# EasyEDA Pro project ProPrj_transverter-front-end_2026-04-14.epro, board 1-PCB_PCB_transverter-core-board
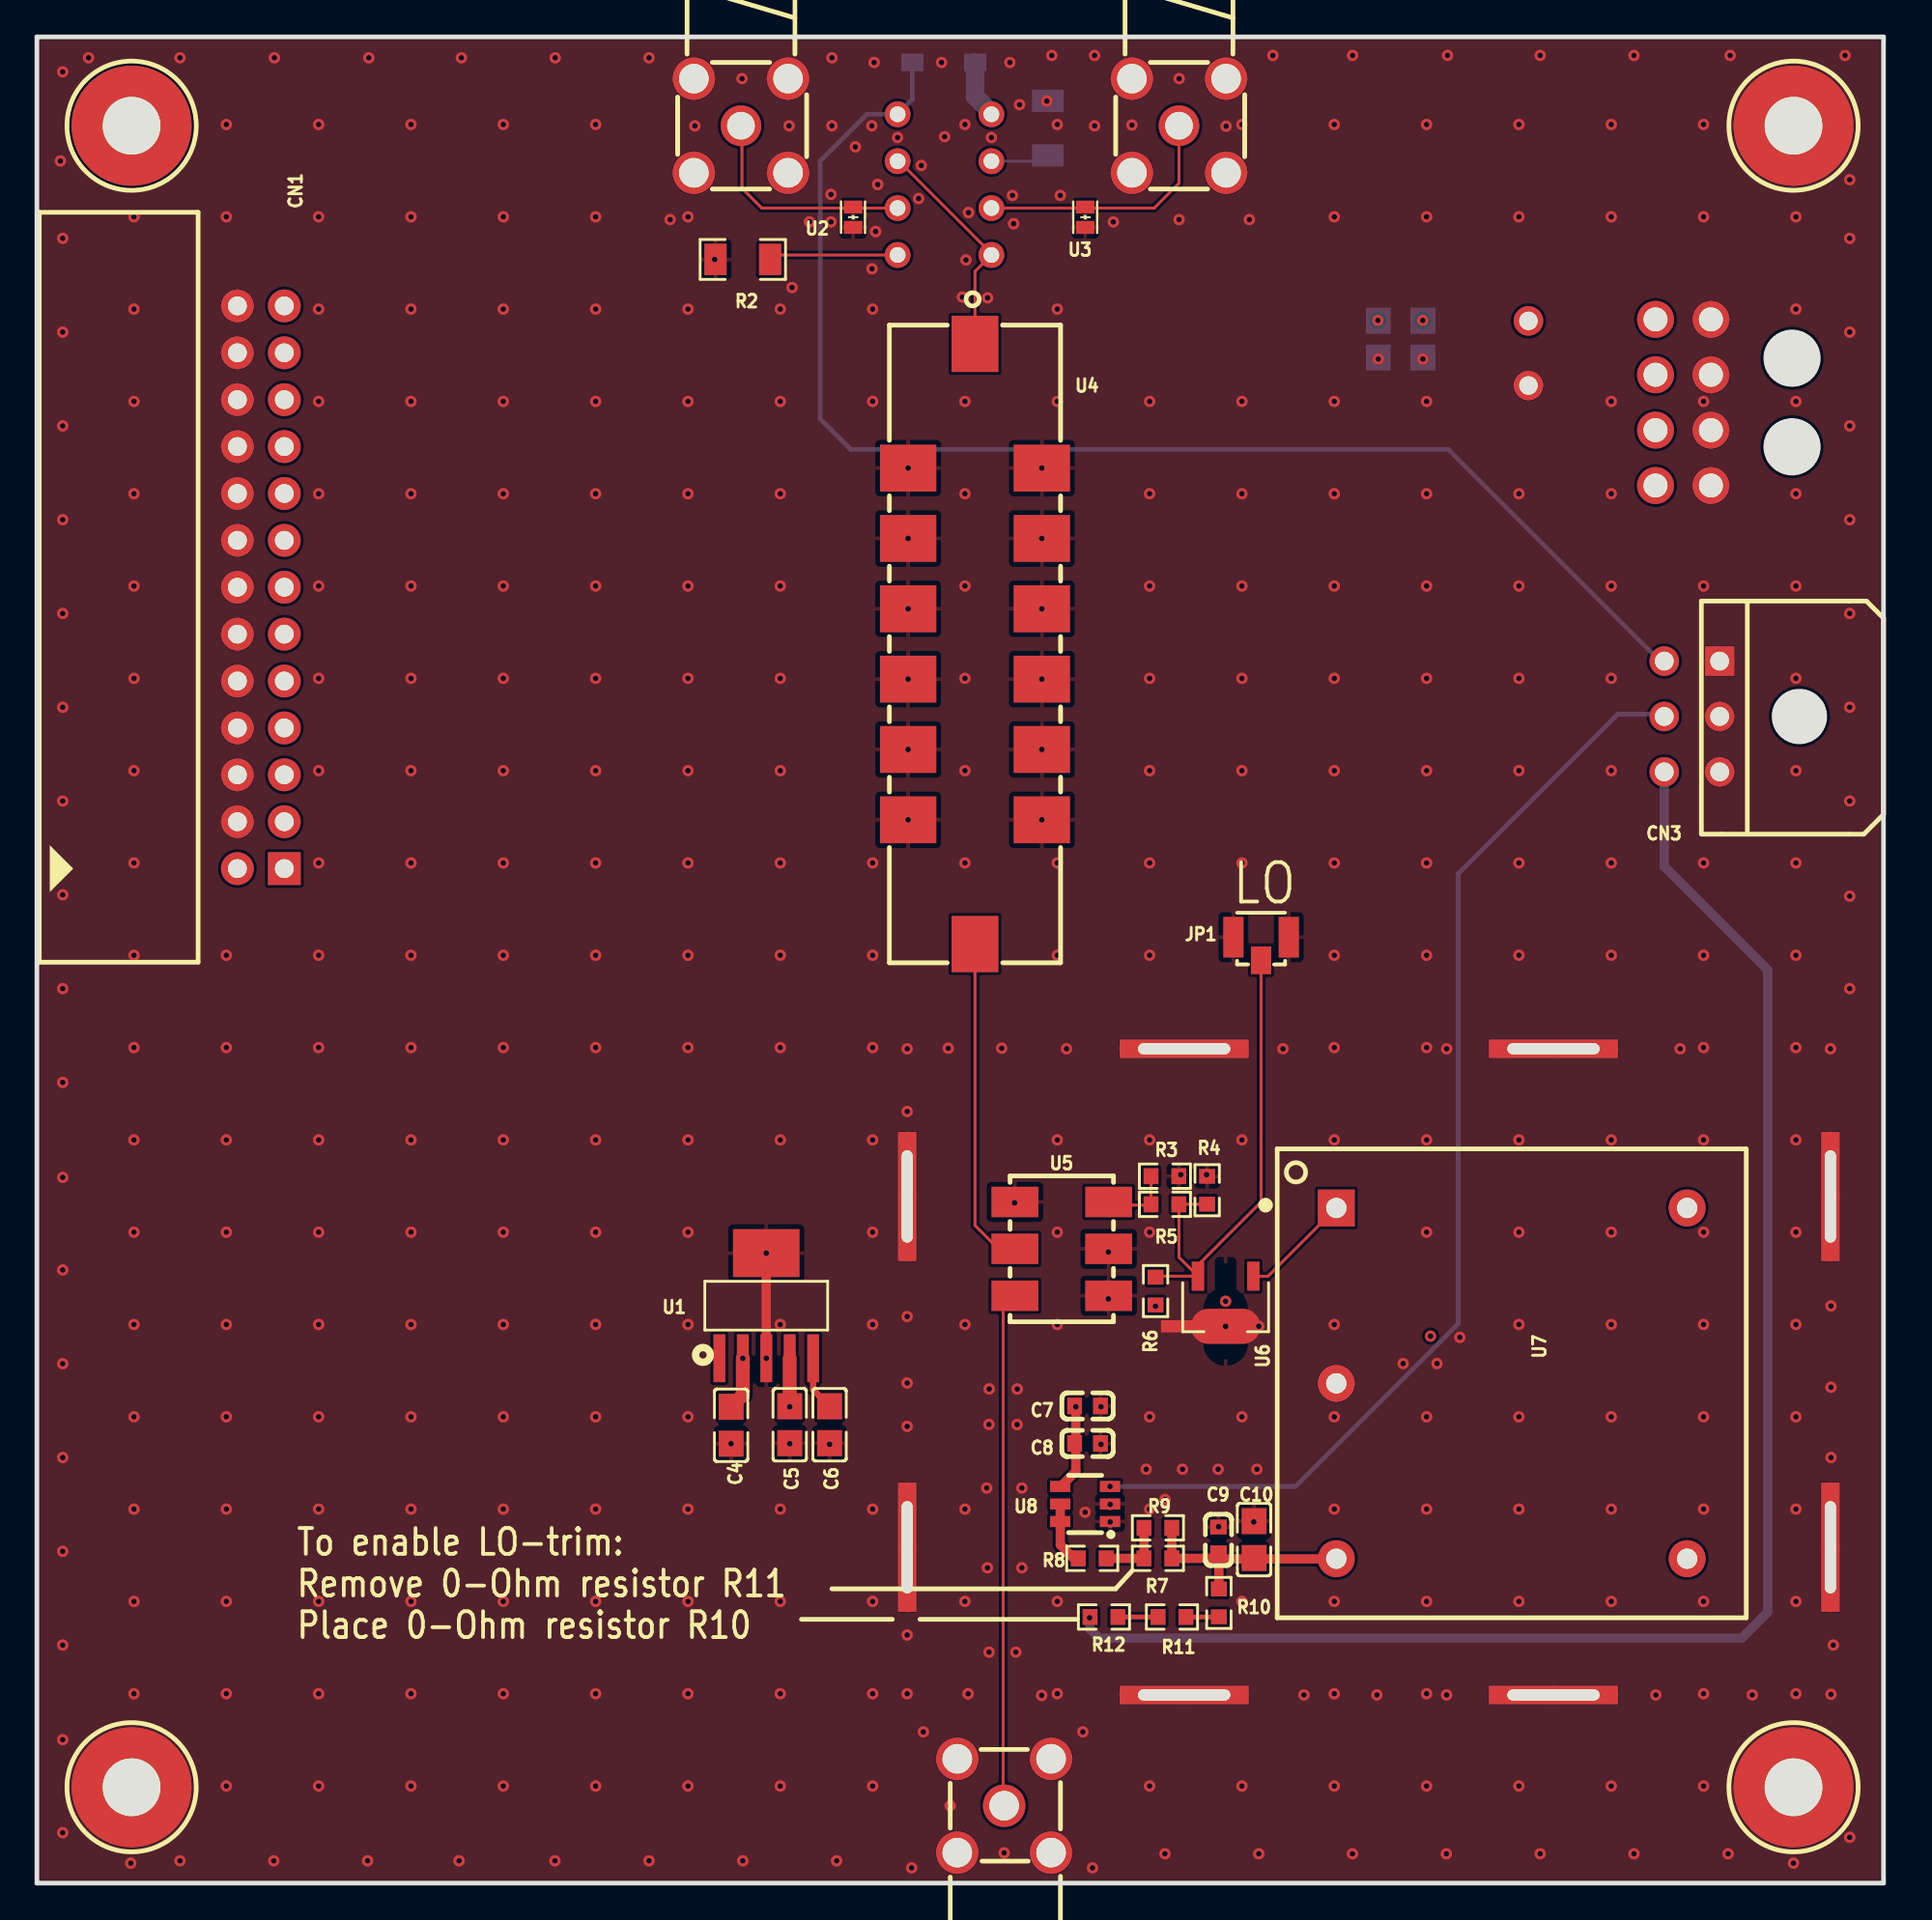
[diagram p5: board, top side]
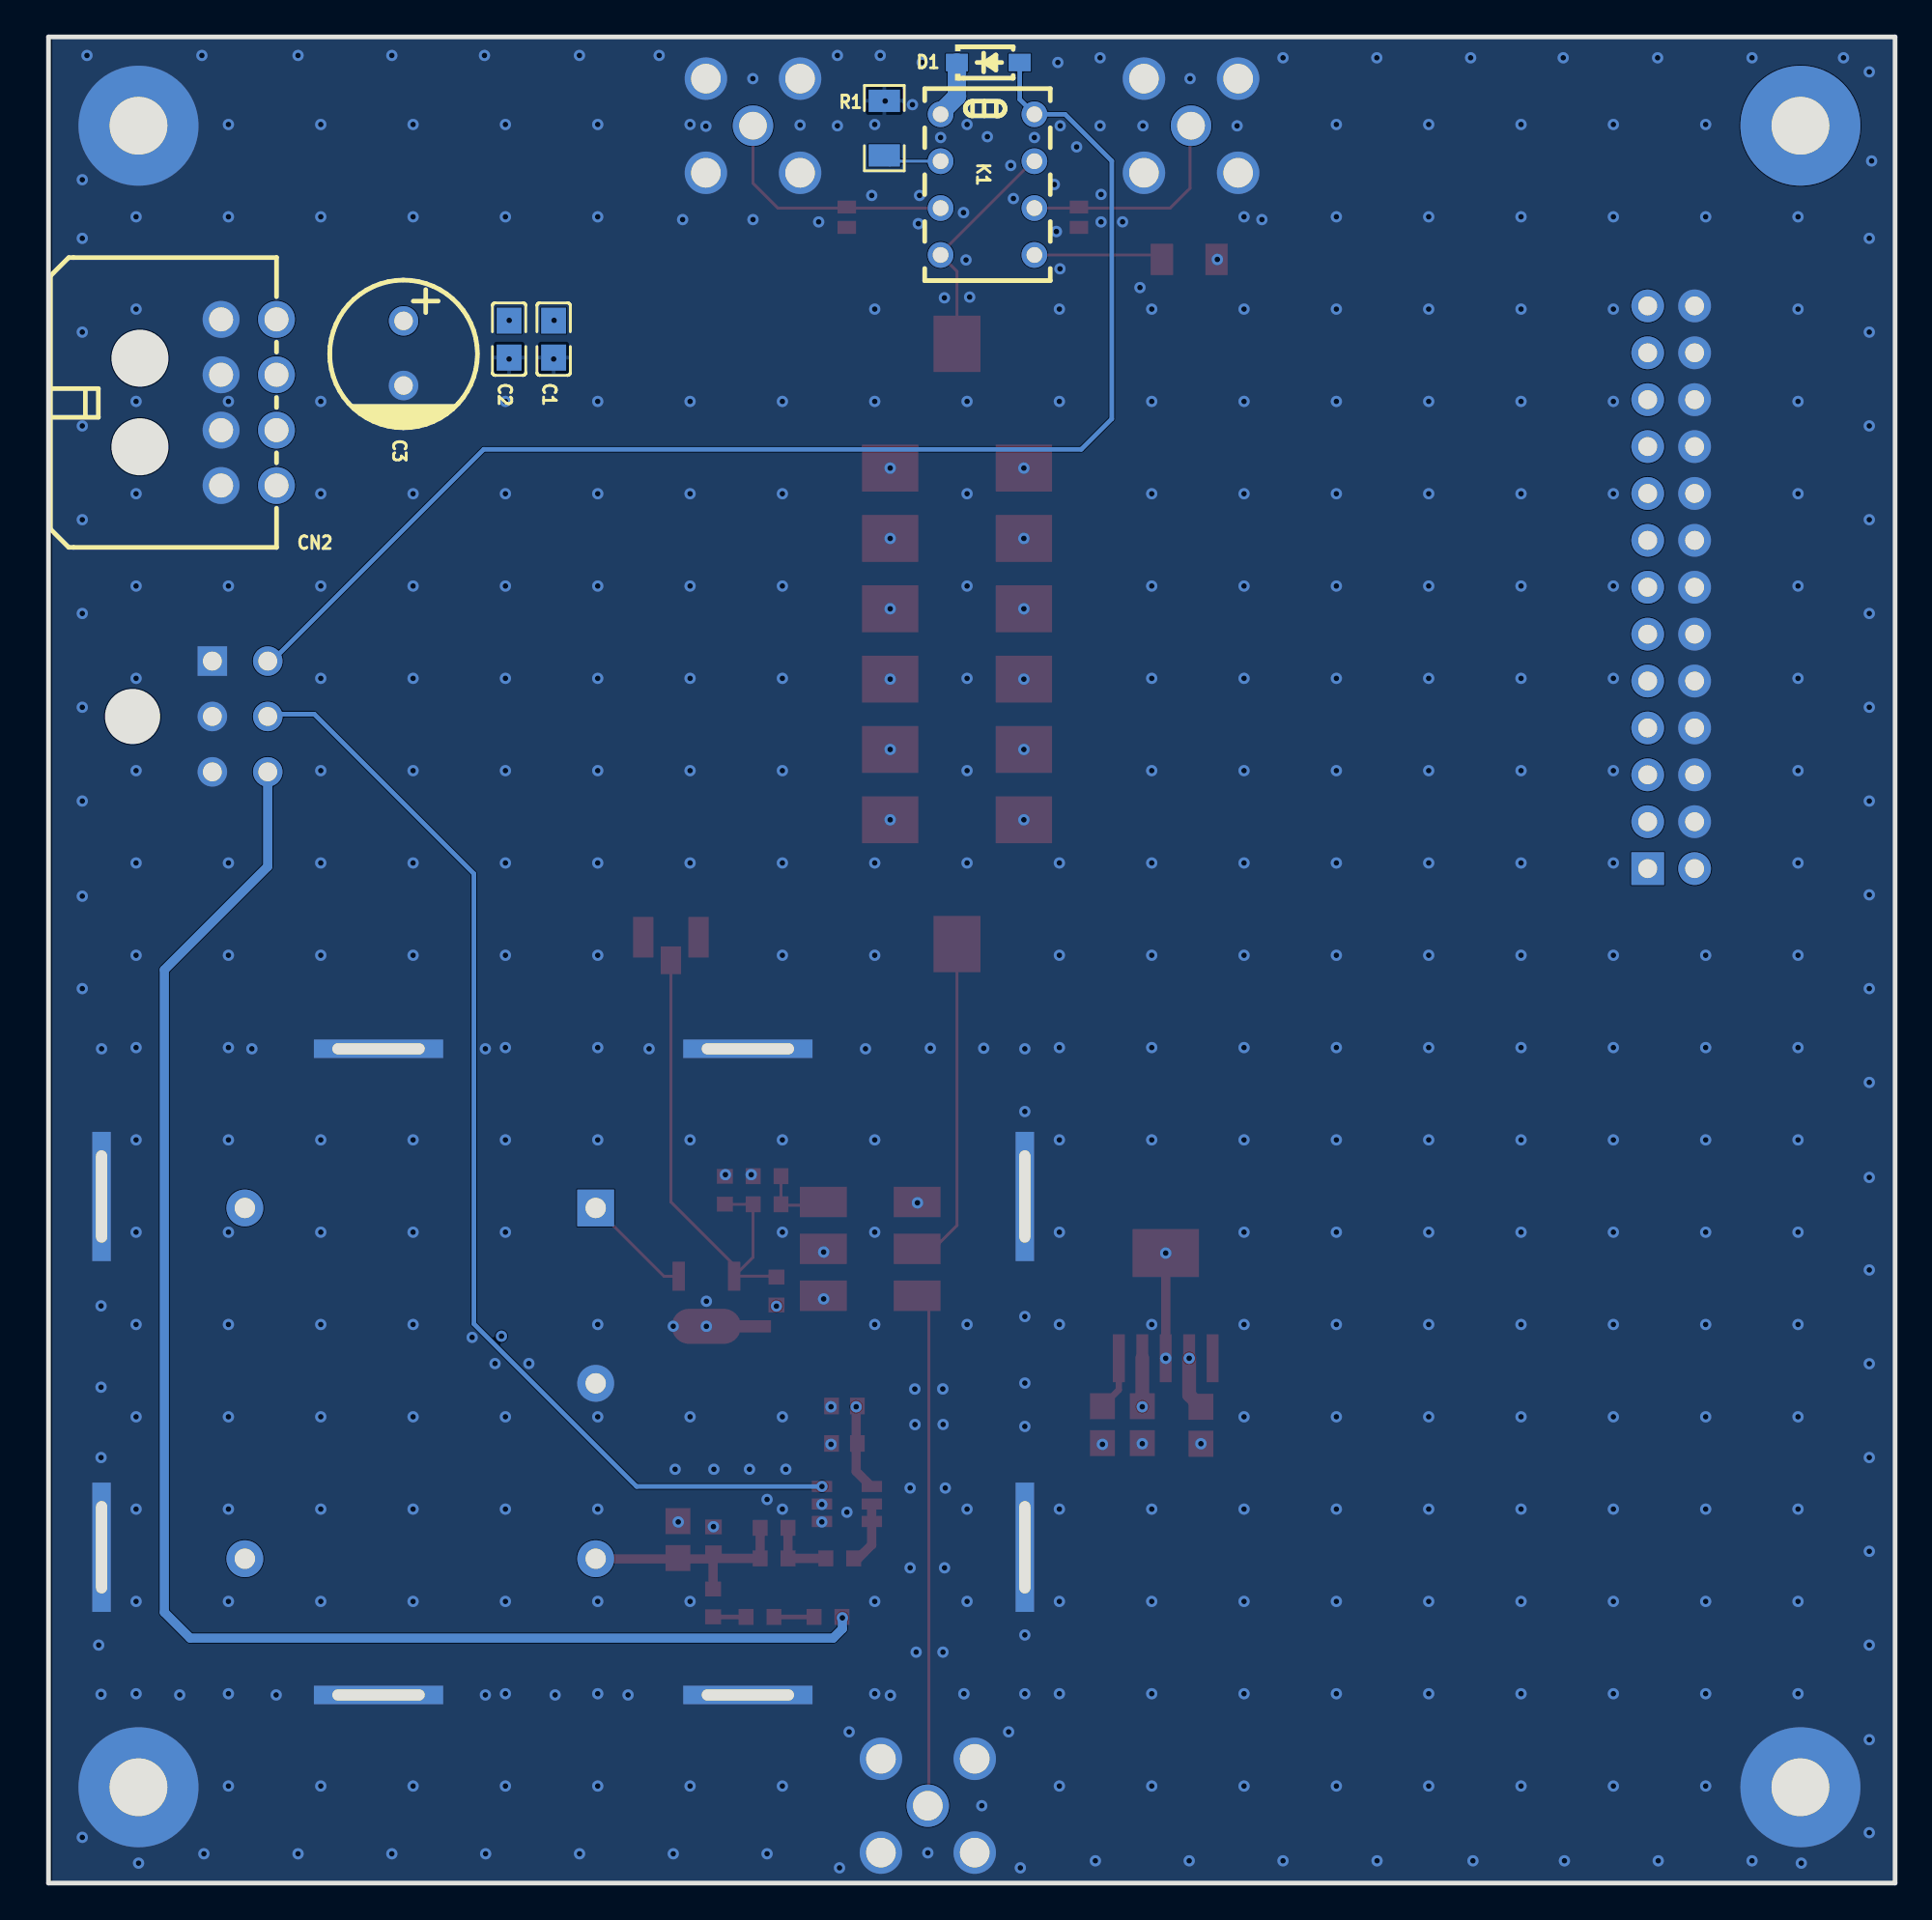
[diagram p6: board, bottom side, seen from below]

Outline 100 x 100 mm; copper layers: Top Layer, Inner1, Inner2, Bottom Layer. Coordinates in mm from the lower left corner of the outline.
Outline path: 0,100 100,100 100,0 0,0 0,100
Stack: Top Layer 0.035mm / Dielectric1 0.48mm PP er 4.5 / Inner1 0.035mm / Dielectric2 0.48mm FR4 er 4.5 / Inner2 0.035mm / Dielectric3 0.48mm PP er 4.5 / Bottom Layer 0.035mm

## Design rules (mm)
net TO-BPF: RF
net LO-AMP-OUT: RF
net LO-PI-PAD-OUT: RF
net LO-OUT: RF
net IF-BPF-IN: RF
net IF-BPF-OUT: RF
net RX_TERMINATION: RF
net TX_TERMINATION: RF
net RX: RF
net TX: RF
template: User Custom Config
spacing Default (default): track to track 0.152, other pairs 0 to 0.152
spacing RF: track to track 1, other pairs 0 to 0.65
spacing small_components: track to track 0.152, other pairs 0.152 to 0.3
spacing control_lines: track to track 0.5, other pairs 0.152 to 0.3
spacing small_power: track to track 0.6, other pairs 0.152 to 0.3
spacing main_power: track to track 2, other pairs 0.152 to 0.3
spacing clean_voltage: track to track 0.152, other pairs 0.152 to 0.3
spacing relay_power: track to track 1, other pairs 0.152 to 0.3
spacing ground_guard: track to track 0.3, other pairs 0.152 to 0.3
track width Default (default): min 0.254, default 0.254, max 25.4
track width RF: min 0.157, default 0.157, max 0.157
track width control_lines: min 0.25, default 0.25, max 0.26
track width small_power: min 0.5, default 0.5, max 2.54
track width main_power: min 1.5, default 1.5, max 3
track width relay_power: min 1, default 1, max 1.25
differential pair differentialPair (default): width min 0.127, default 0.254, max 2.54; gap min 0.152, default 0.152
via Default (default): diameter min 0.61, default 0.61, max 100.025; hole min 0.305, default 0.305, max 59.995
via RF: diameter min 0.61, default 0.61, max 100.025; hole min 0.305, default 0.305, max 59.995
net class RF uses RF
net NOISY-5V uses relay_power
net RLY-TXRX-EN uses control_lines
net NOISY-5.3V uses small_power
net CLEAN-5V uses clean_voltage, small_power
net TO-BPF uses RF
net LO-VREF uses small_power
net LO-TRIM uses small_power
net 2.5V-REF uses clean_voltage, small_power
net LO-AMP-OUT uses RF
net LO-PI-PAD-OUT uses RF
net LO-OUT uses RF
net IF-BPF-IN uses RF
net IF-BPF-OUT uses RF
net RX_TERMINATION uses RF
net TX_TERMINATION uses RF
net RX uses RF
net TX uses RF
net 2.5V-REF-EN uses control_lines
['net class', 'rf'] ['NET', 'GND'] uses ground_guard
pour e48 uses gge25779
pour e50 uses gge19105
pour e28 uses Default

## Placement (name value [footprint] x y rotation side)
C1  100nF  [C0805]  72.64 83.63 270 bottom
C2  1uF  [C0805]  75.06 83.63 270 bottom
C3  47 µF  [CAP-TH_BD8.0-P3.50-D0.6-FD]  80.77 82.87 270 bottom
C4  2.2uF  [C0805]  37.59 24.8 270 top
C5  1uF  [C0805]  40.77 24.83 90 top
C6  2.2uF  [C0805]  42.93 24.83 90 top
C7  100nF  [C0603]  56.9 25.84 180 top
C8  1uF  [C0603]  56.9 23.81 0 top
C9  100nF  [C0603]  63.99 18.59 270 top
C10  10uF  [C0805]  65.91 18.61 90 top
CN1  SBH11-PBPC-D13-RA-BK  [IDC-TH_26P-P2.54-H-M-R2-C13-W8.8]  12.13 70.19 270 top
CN2  4x2 connector  [CONN-TH_0430450800]  89.15 80.2 270 bottom
CN3  430450602  [CONN-TH_6P-P3.00_43045-0600]  89.63 63.19 90 top
D1  1N4148W-7-F  [SOD-123_L2.7-W1.6-LS3.7-RD-1]  49.1 98.62 180 bottom
JP1  U.FL-R-SMT-1(10)  [ANT-SMD_UFL-R-SMT-1-10]  66.29 50.61 90 top
K1  G6K-2P DC5  [RELAY-TH_G6K-2P]  49.15 92 270 bottom
NOREF  -  [Pad_e4738]  47.13 37.19 0 top
NOREF#2  -  [Pad_e2649]  5.13 95.19 0 top
NOREF#3  -  [Pad_e4742]  62.13 45.19 270 top
NOREF#4  -  [Pad_e1800]  47.13 18.19 0 top
NOREF#5  -  [Pad_e2651]  95.13 95.19 0 top
NOREF#6  -  [Pad_e4739]  97.13 18.19 0 top
NOREF#7  -  [Pad_e4744]  62.13 10.19 270 top
NOREF#8  -  [Pad_e4743]  82.13 10.19 270 top
NOREF#9  -  [Pad_e4741]  82.13 45.19 270 top
NOREF#10  -  [Pad_e2652]  95.13 5.19 0 top
NOREF#11  -  [Pad_e2653]  5.13 5.19 0 top
NOREF#12  -  [Pad_e4740]  97.13 37.19 0 top
R1  50Ω  [R1206]  54.74 95.06 90 bottom
R2  50Ω  [R1206]  38.23 87.95 0 top
R3  470Ω  [R0603_NEW]  61.09 38.29 180 top
R4  470Ω  [R0603_NEW]  63.37 37.53 270 top
R5  10Ω  [R0603_NEW]  61.09 36.77 0 top
R6  0Ω  [R0603_NEW]  60.58 32.07 90 top
R7  0Ω  [R0603_NEW]  60.71 17.59 180 top
R8  100Ω  [R0603]  57.15 17.59 180 top
R9  1kΩ  [R0603_NEW]  60.71 19.24 180 top
R10  200kΩ  [R0603]  64.01 15.18 270 top
R11  1kΩ  [R0603_NEW]  61.47 14.41 180 top
R12  0Ω  [R0603_NEW]  57.78 14.41 180 top
SMA1  RX1  [SMA-TH_CONSMA002-L-G]  38.13 95.19 90 top
SMA2  TX1  [SMA-TH_CONSMA002-L-G]  61.85 95.19 90 top
SMA3  TO-CONTROL  [ANT-TH_SMA-J-P-H-RA-TH1]  52.38 4.19 90 top
U1  TPS79650DCQR  [SOT-223-6_L6.5-W3.5-P1.27-LS7.0-BR]  39.5 31.28 270 top
U2  CPDUR5V0R-HF  [SOD-523F_L1.7-W1.0-BI]  44.2 90.23 90 top
U3  CPDUR5V0R-HF  [SOD-523F_L1.7-W1.0-BI]  56.77 90.23 90 top
U4  BPF-A120+  [FILTER-SMD_14P-L34.5-W9.3_BPF-A950]  50.8 67.12 270 top
U5  ADE-1MHW+  [XFMR-SMD_L7.9-W5.6-P2.54_ADTT1-6]  55.5 34.35 270 top
U6  GVA-81+  [SOT-89-3_L4.5-W2.4-P1.50-LS4.0-BR]  64.37 31.51 90 top
U7  OH100-71005SV-100.0M  [OSC-TH_5P-L25.4-W25.4-P9.50-TL]  79.87 27.07 0 top
U8  REF3425IDBVR  [SOT-23-6_L2.9-W1.6-P0.95-LS2.8-BR]  56.76 20.53 0 top

## Footprints (pads in the part's own frame, mm; a bottom-side part is the same pattern mirrored in y, then rotated)
ANT-SMD_UFL-R-SMT-1-10
  rect 2.2x1.1 smd: 1(0.625,1.5) 3(0.625,-1.5)
  rect 1.5x1.1 smd: 2(-0.625,0.002)
ANT-TH_SMA-J-P-H-RA-TH1
  round 2.3 hole 1.6: 1(-2.54,2.54) 2(2.54,2.54) 3(2.54,-2.54) 4(-2.54,-2.54) 5(0,0)
C0603
  rect 0.8x0.9 smd: 1(-0.7,0) 2(0.7,0)
C0805
  rect 1.41x1.35 smd: 1(-1,0) 2(1,0)
CAP-TH_BD8.0-P3.50-D0.6-FD
  round 1.6 hole 1: 1(-1.75,0) 2(1.75,0)
CONN-TH_6P-P3.00_43045-0600
  rect 1.6x1.6 hole 1.02: 1(3,-1.5)
  round 1.6 hole 1.02: 2(0,-1.5) 3(-3,-1.5) 4(3,1.5) 5(0,1.5) 6(-3,1.5)
CONN-TH_0430450800
  round 2 hole 1.3: 1(4.5,-1.5) 2(1.5,-1.5) 3(-1.5,-1.5) 4(-4.5,-1.5) 5(4.5,1.5) 6(1.5,1.5) 7(-1.5,1.5) 8(-4.5,1.5)
FILTER-SMD_14P-L34.5-W9.3_BPF-A950
  rect 3.05x2.54 smd: 1(-16.255,0) 8(16.255,0)
  rect 2.54x3.05 smd: 2(-9.525,-3.62) 3(-5.715,-3.62) 4(-1.905,-3.62) 5(1.905,-3.62) 6(5.715,-3.62) 7(9.525,-3.62) 9(9.525,3.62) 10(5.715,3.62) 11(1.905,3.62) 12(-1.905,3.62) 13(-5.715,3.62) 14(-9.525,3.62)
IDC-TH_26P-P2.54-H-M-R2-C13-W8.8
  rect 1.778x1.778 hole 1.02: 1(15.24,1.27)
  round 1.778 hole 1.02: 2(15.24,-1.27) 3(12.7,1.27) 4(12.7,-1.27) 5(10.16,1.27) 6(10.16,-1.27) 7(7.62,1.27) 8(7.62,-1.27) 9(5.08,1.27) 10(5.08,-1.27) 11(2.54,1.27) 12(2.54,-1.27) 13(0,1.27) 14(0,-1.27) 15(-2.54,1.27) 16(-2.54,-1.27) 17(-5.08,1.27) 18(-5.08,-1.27) 19(-7.62,1.27) 20(-7.62,-1.27) 21(-10.16,1.27) 22(-10.16,-1.27) 23(-12.7,1.27) 24(-12.7,-1.27) 25(-15.24,1.27) 26(-15.24,-1.27)
OSC-TH_5P-L25.4-W25.4-P9.50-TL
  rect 2x2 hole 1.1: 1(-9.5,9.5)
  round 2 hole 1.1: 2(-9.5,0) 3(-9.5,-9.5) 4(9.5,-9.5) 5(9.5,9.5)
Pad_e1800
  rect 1x7 hole 0.6x5: 1(0,0)
Pad_e2649
  round 6.5 hole 3.125: 1(0,0)
Pad_e2651
  round 6.5 hole 3.125: 1(0,0)
Pad_e2652
  round 6.5 hole 3.125: 1(0,0)
Pad_e2653
  round 6.5 hole 3.125: 1(0,0)
Pad_e4738
  rect 1x7 hole 0.6x5: 1(0,0)
Pad_e4739
  rect 1x7 hole 0.6x5: 1(0,0)
Pad_e4740
  rect 1x7 hole 0.6x5: 1(0,0)
Pad_e4741
  rect 1x7 hole 0.6x5: 1(0,0)
Pad_e4742
  rect 1x7 hole 0.6x5: 1(0,0)
Pad_e4743
  rect 1x7 hole 0.6x5: 1(0,0)
Pad_e4744
  rect 1x7 hole 0.6x5: 1(0,0)
R0603
  rect 0.806x0.864 smd: 1(-0.753,0) 2(0.753,0)
R0603_NEW
  rect 0.806x0.864 smd: 1(-0.753,0) 2(0.753,0)
R1206
  rect 1.208x1.701 smd: 1(-1.479,0) 2(1.479,0)
RELAY-TH_G6K-2P
  round 1.4 hole 0.85: 1(-3.81,-2.54) 2(-1.27,-2.54) 3(1.27,-2.54) 4(3.81,-2.54) 5(3.81,2.54) 6(1.27,2.54) 7(-1.27,2.54) 8(-3.81,2.54)
SMA-TH_CONSMA002-L-G
  round 2.2 hole 1.5: 1(0,0)
  round 2.3 hole 1.6: 2(-2.55,2.55) 3(-2.55,-2.55) 4(2.55,-2.55) 5(2.55,2.55)
SOD-123_L2.7-W1.6-LS3.7-RD-1
  rect 1.2x0.95 smd: 1(-1.7,0) 2(1.7,0)
SOD-523F_L1.7-W1.0-BI
  rect 0.7x1 smd: 1(-0.55,0) 2(0.55,0)
SOT-23-6_L2.9-W1.6-P0.95-LS2.8-BR
  rect 1.1x0.6 smd: 1(1.35,-0.95) 2(1.35,0) 3(1.35,0.95) 4(-1.35,0.95) 5(-1.35,0) 6(-1.35,-0.95)
SOT-89-3_L4.5-W2.4-P1.50-LS4.0-BR
  rect 1.575x0.672 smd: 1(1.357,-1.5) 3(1.357,1.5)
  custom 1.9x5.377 smd: 2(-1.357,-0.001)
SOT-223-6_L6.5-W3.5-P1.27-LS7.0-BR
  rect 2.595x0.644 smd: 1(2.848,-2.54) 2(2.848,-1.27) 3(2.848,0) 4(2.848,1.27) 5(2.848,2.54)
  rect 2.595x3.6 smd: 6(-2.848,0)
XFMR-SMD_L7.9-W5.6-P2.54_ADTT1-6
  rect 1.65x2.54 smd: 1(-2.54,-2.54) 2(0,-2.54) 3(2.54,-2.54) 4(2.54,2.54) 5(0,2.54) 6(-2.54,2.54)

## Nets
As in the schematic, except:
GND: C1.2 C2.2 C3.2 C4.2 C5.1 C6.1 C7.1 C8.2 C9.1 C10.2 CN1.4 CN1.6 CN1.8 CN1.10 CN1.12 CN1.14 CN1.16 CN1.18 CN1.20 CN1.22 CN1.24 CN1.26 CN2.1 CN2.2 CN2.3 CN2.4 CN3.1 CN3.2 CN3.3 JP1.1 JP1.3 NOREF.1 NOREF#3.1 NOREF#4.1 NOREF#5.1 NOREF#6.1 NOREF#7.1 NOREF#8.1 NOREF#9.1 NOREF#10.1 NOREF#11.1 NOREF#12.1 R1.2 R2.1 R3.1 R4.1 SMA1.2 SMA1.3 SMA1.4 SMA1.5 SMA2.2 SMA2.3 SMA2.4 SMA2.5 SMA3.1 SMA3.2 SMA3.3 SMA3.4 U1.3 U1.6 U2.1 U3.1 U4.2 U4.3 U4.4 U4.5 U4.6 U4.7 U4.9 U4.10 U4.11 U4.12 U4.13 U4.14 U5.1 U5.4 U5.5 U6.2 U7.2 U8.1 U8.2

Pads without a net: CN1 1 2 3 5 7 9 11 13 15 17 19 21 23 25; NOREF#2 1; U1 1; U7 4

## Via types
v1: diameter 0.61, hole 0.305, Top Layer to Bottom Layer, 445 vias
v2: diameter 0.62, hole 0.31, Top Layer to Bottom Layer, 42 vias

## Routing (per net, layer and track width the routed paths; a pad name or vN(x,y) marks a point on that pad's centre or on a via; arc(x,y) is an arc through that point)
2.5V-REF: length 3.5
  Top Layer w0.5: U8.5 55.42,20.53 55.42,18.32 56.15,17.59 R8.2
2.5V-REF-EN: length 61.7
  Bottom Layer w0.254: CN3.5 88,63.32 85.61,63.32 76.96,54.67 76.96,30.29 68.16,21.48 v1(58.11,21.48)
GND: length 5.7
  Top Layer w0.5: v2(39.5,28.43) v2(39.5,34.12)
  vias: v1(1.27,93.28) v1(1.4,98.11) v1(1.4,89.09) v1(1.4,84.01) v1(1.4,78.93) v1(1.4,73.85) v1(1.4,68.77) v1(1.4,63.69) v1(1.4,58.61) v1(1.4,53.53) v1(1.4,48.45) v1(1.4,43.37) v1(1.4,38.22) v1(1.4,33.21) v1(1.4,28.13) v1(1.4,23.05) v1(1.4,17.97) v1(1.4,12.89) v1(1.4,7.77) v1(1.4,2.73) v1(2.79,98.87) v1(5.08,1.08) v1(5.26,90.26) v1(5.26,85.26) v1(5.26,80.26) v1(5.26,75.26) v1(5.26,70.26) v1(5.26,65.26) v1(5.26,60.26) v1(5.26,55.26) v1(5.26,50.26) v1(5.26,45.26) v1(5.26,40.26) v1(5.26,35.26) v1(5.26,30.26) v1(5.26,25.26) v1(5.26,20.26) v1(5.26,15.26) v1(5.26,10.26) v1(7.75,98.87) v1(7.75,1.21) v1(10.26,95.26) v1(10.26,90.26) v1(10.26,50.26) v1(10.26,45.26) v1(10.26,40.26) v1(10.26,35.26) v1(10.26,30.26) v1(10.26,25.26) v1(10.26,20.26) v1(10.26,15.26) v1(10.26,10.26) v1(10.26,5.26) v1(12.86,98.87) v1(12.83,1.21) v1(15.26,95.26) v1(15.26,90.26) v1(15.26,85.26) v1(15.26,80.26) v1(15.26,75.26) v1(15.26,70.26) v1(15.26,65.26) v1(15.26,60.26) v1(15.26,55.26) v1(15.26,50.26) v1(15.26,45.26) v1(15.26,40.26) v1(15.26,35.26) v1(15.26,30.26) v1(15.26,25.26) v1(15.26,20.26) v1(15.26,15.26) v1(15.26,10.26) v1(15.26,5.26) v1(17.97,98.87) v1(17.91,1.21) v1(20.26,95.26) v1(20.26,90.26) v1(20.26,85.26) v1(20.26,80.26) v1(20.26,75.26) v1(20.26,70.26) v1(20.26,65.26) v1(20.26,60.26) v1(20.26,55.26) v1(20.26,50.26) v1(20.26,45.26) v1(20.26,40.26) v1(20.26,35.26) v1(20.26,30.26) v1(20.26,25.26) v1(20.26,20.26) v1(20.26,15.26) v1(20.26,10.26) v1(20.26,5.26) v1(22.86,1.21) v1(22.99,98.87) v1(25.26,95.26) v1(25.26,90.26) v1(25.26,85.26) v1(25.26,80.26) v1(25.26,75.26) v1(25.26,70.26) v1(25.26,65.26) v1(25.26,60.26) v1(25.26,55.26) v1(25.26,50.26) v1(25.26,45.26) v1(25.26,40.26) v1(25.26,35.26) v1(25.26,30.26) v1(25.26,25.26) v1(25.26,20.26) v1(25.26,15.26) v1(25.26,10.26) v1(25.26,5.26) v1(28.07,98.87) v1(28.05,1.21) v1(30.26,95.26) v1(30.26,90.26) v1(30.26,85.26) v1(30.26,80.26) v1(30.26,75.26) v1(30.26,70.26) v1(30.26,65.26) v1(30.26,60.26) v1(30.26,55.26) v1(30.26,50.26) v1(30.26,45.26) v1(30.26,40.26) v1(30.26,35.26) v1(30.26,30.26) v1(30.26,25.26) v1(30.26,20.26) v1(30.26,15.26) v1(30.26,10.26) v1(30.26,5.26) v1(33.15,98.87) v1(33.15,1.21) v1(34.29,90.11) v1(35.26,90.26) v1(35.26,85.26) v1(35.26,80.26) v1(35.26,75.26) v1(35.26,70.26) v1(35.26,65.26) v1(35.26,60.26) v1(35.26,55.26) v1(35.26,50.26) v1(35.26,45.26) v1(35.26,40.26) v1(35.26,35.26) v1(35.26,30.26) v1(35.26,25.26) v1(35.26,20.26) v1(35.26,15.26) v1(35.26,10.26) v1(35.26,5.26) v1(35.63,95.18) v1(38.18,97.74) v1(38.23,1.21) v1(40.26,85.26) v1(40.26,80.26) v1(40.26,75.26) v1(40.26,70.26) v1(40.26,65.26) v1(40.26,60.26) v1(40.26,55.26) v1(40.26,50.26) v1(40.26,45.26) v1(40.26,40.26) v1(40.26,30.26) v1(40.26,20.26) v1(40.26,15.26) v1(40.26,10.26) v1(40.26,5.26) v1(40.73,95.18) v1(40.89,86.42) v1(41.83,89.98) v1(43.05,98.87) v1(43.05,95.19) v1(43,91.47) v1(43,89.98) v1(43.31,1.21) v1(44.32,94.04) v1(45.21,95.19) v1(45.22,87.44) v1(45.26,85.26) v1(45.26,80.26) v1(45.26,55.26) v1(45.26,50.26) v1(45.26,45.26) v1(45.26,40.26) v1(45.26,35.26) v1(45.26,30.26) v1(45.26,20.26) v1(45.26,15.26) v1(45.26,10.26) v1(45.26,5.26) v1(45.34,98.62) v1(46.61,94.55) v1(47.13,45.19) v1(47.13,41.79) v1(47.13,30.69) v1(47.13,27.08) v1(47.13,24.73) v1(47.13,13.44) v1(47.13,10.25) v1(47.37,0.83) v1(47.75,91.25) v1(47.89,93.04) v1(48.01,8.19) v1(48.99,98.62) v1(49.16,94.6) v1(49.35,45.22) v1(49.46,4.19) v1(50.12,85.91) v1(50.26,95.26) v1(50.26,80.26) v1(50.26,75.26) v1(50.26,70.26) v1(50.26,65.26) v1(50.26,60.26) v1(50.26,55.26) v1(50.26,30.26) v1(50.26,20.26) v1(50.26,15.26) v1(50.31,87.92) v1(51.43,21.4) v1(51.47,17.08) v1(51.48,85.87) v1(51.55,24.84) v1(51.56,12.51) v1(51.69,94.55) v1(52.25,45.22) v1(52.38,1.64) v1(52.69,98.62) v1(52.83,91.41) v1(53.01,12.51) v1(53.21,96.33) v1(53.34,21.4) v1(53.34,17.08) v1(54.96,99) v1(55.26,95.26) v1(55.26,85.26) v1(55.26,80.26) v1(55.26,55.26) v1(55.26,50.26) v1(55.26,40.26) v1(55.26,35.26) v1(55.26,30.26) v1(55.26,15.26) v1(55.26,10.26) v1(55.42,91.41) v1(55.76,45.19) v1(56.64,8.19) v1(56.76,20.09) v1(57.16,0.83) v1(57.28,99) v1(57.28,95.19) v1(58.12,20.51) v1(58.12,19.56) v1(58.29,89.98) v1(59.3,95.23) v1(60.07,22.42) v1(60.26,80.26) v1(60.26,75.26) v1(60.26,70.26) v1(60.26,65.26) v1(60.26,60.26) v1(60.26,55.26) v1(60.26,50.26) v1(60.26,40.26) v1(60.26,35.26) v1(60.26,25.26) v1(60.26,20.26) v1(60.26,5.26) v1(61.09,20.78) v1(61.09,1.59) v1(61.86,97.74) v1(61.85,90.11) v1(62.04,22.42) v1(63.97,22.42) v1(64.37,31.51) v1(64.4,95.16) v1(65.26,95.26) v1(65.26,80.26) v1(65.26,75.26) v1(65.26,70.26) v1(65.26,65.26) v1(65.26,60.26) v1(65.26,55.26) v1(65.26,40.26) v1(65.26,25.26) v1(65.26,15.26) v1(65.26,5.26) v1(65.66,90.11) v1(66.06,22.42) v1(66.17,30.16) v1(66.17,1.59) v1(66.93,99) v1(67.47,45.19) v1(68.61,10.19) v1(70.26,95.26) v1(70.26,90.26) v1(70.26,80.26) v1(70.26,75.26) v1(70.26,70.26) v1(70.26,65.26) v1(70.26,60.26) v1(70.26,55.26) v1(70.26,50.26) v1(70.26,45.26) v1(70.26,40.26) v1(70.26,30.26) v1(70.26,25.26) v1(70.26,20.26) v1(70.26,15.26) v1(70.26,10.26) v1(70.26,5.26) v1(71.25,99) v1(71.24,1.59) v1(72.56,10.19) v1(72.64,82.55) v1(73.99,28.14) v1(75.06,82.55) v1(75.26,95.26) v1(75.26,90.26) v1(75.26,80.26) v1(75.26,75.26) v1(75.26,70.26) v1(75.26,65.26) v1(75.26,60.26) v1(75.26,55.26) v1(75.26,50.26) v1(75.26,45.26) v1(75.26,40.26) v1(75.26,35.26) v1(75.26,25.26) v1(75.26,20.26) v1(75.26,15.26) v1(75.26,10.26) v1(75.26,5.26) v1(75.82,28.14) v1(76.34,45.19) v1(76.34,10.19) v1(76.33,1.59) v1(76.39,99) v1(77.06,29.56) v1(80.26,95.26) v1(80.26,90.26) v1(80.26,75.26) v1(80.26,70.26) v1(80.26,65.26) v1(80.26,60.26) v1(80.26,55.26) v1(80.26,50.26) v1(80.26,40.26) v1(80.26,35.26) v1(80.26,30.26) v1(80.26,25.26) v1(80.26,20.26) v1(80.26,15.26) v1(80.26,5.26) v1(81.41,99) v1(81.41,1.59) v1(85.26,95.26) v1(85.26,90.26) v1(85.26,80.26) v1(85.26,75.26) v1(85.26,70.26) v1(85.26,65.26) v1(85.26,60.26) v1(85.26,55.26) v1(85.26,50.26) v1(85.26,40.26) v1(85.26,35.26) v1(85.26,30.26) v1(85.26,25.26) v1(85.26,20.26) v1(85.26,15.26) v1(85.26,5.26) v1(86.49,99) v1(86.49,1.59) v1(87.67,10.19) v1(88.99,45.19) v1(90.26,95.26) v1(90.26,90.26) v1(90.26,80.26) v1(90.26,70.26) v1(90.26,55.26) v1(90.26,50.26) v1(90.26,45.26) v1(90.26,40.26) v1(90.26,35.26) v1(90.26,30.26) v1(90.26,25.26) v1(90.26,20.26) v1(90.26,15.26) v1(90.26,10.26) v1(90.26,5.26) v1(91.58,1.59) v1(91.69,99) v1(92.89,10.19) v1(95.12,1.08) v1(95.26,90.26) v1(95.26,85.26) v1(95.26,80.26) v1(95.26,75.26) v1(95.26,70.26) v1(95.26,65.26) v1(95.26,60.26) v1(95.26,55.26) v1(95.26,50.26) v1(95.26,45.26) v1(95.26,40.26) v1(95.26,35.26) v1(95.26,30.26) v1(95.26,25.26) v1(95.26,20.26) v1(95.26,15.26) v1(95.26,10.26) v1(97.13,45.19) v1(97.15,31.26) v1(97.15,26.86) v1(97.15,23.05) v1(97.15,10.22) v1(97.28,12.89) v1(97.92,99) v1(98.17,92.27) v1(98.17,89.09) v1(98.17,84.01) v1(98.17,78.93) v1(98.17,73.85) v1(98.17,68.77) v1(98.17,63.69) v1(98.17,58.61) v1(98.17,53.46) v1(98.17,48.45) v1(98.17,2.48) v2(36.7,87.95) v2(37.59,23.8) v2(40.77,23.8) v2(42.93,23.77) v2(45.42,89.46) v2(45.53,92.01) v2(47.18,76.64) v2(47.18,72.83) v2(47.18,69.02) v2(47.18,65.21) v2(47.18,61.4) v2(47.18,57.59) v2(50.45,90.48) v2(50.43,10.25) v2(51.57,26.77) v2(52.89,89.88) v2(52.94,36.85) v2(53.09,26.76) v2(53.08,24.84) v2(54.42,76.64) v2(54.42,72.83) v2(54.42,69.02) v2(54.42,65.21) v2(54.42,61.4) v2(54.42,57.59) v2(54.41,10.17) v2(54.69,96.53) v2(57.63,25.8) v2(57.63,23.77) v2(58.02,34.18) v2(58.02,31.64) v2(61.94,38.37) v2(63.34,38.37) v2(63.99,19.31) v2(64.37,30.16) v2(65.9,19.56)
(no net):
  vias: v1(75.47,29.62)
$C6_2: length 3
  Top Layer w0.342: C6.2 42.04,26.72 U1.5
$R7_2: length 3.7
  Top Layer w0.5: R9.2 R7.2 R8.1
$R10_2: length 1.8
  Top Layer w0.254: R11.1 64,14.41 R10.2
$R11_2: length 2.2
  Top Layer w0.254: R12.1 R11.2
CLEAN-5V: length 63.3
  Top Layer w0.5: v2(56.26,25.8) 56.26,22.3 55.42,21.46
  Top Layer w0.75: U1.4 v2(40.77,25.8)
  Inner2 w0.5: U7.5 81.64,28.85 59.31,28.85 ; v1(60.58,31.25) 60.58,30.12 59.31,28.85 ; 59.31,28.85 56.26,25.8 ; v2(40.77,25.8) v2(56.26,25.8)
IF-BPF-IN: length 13.8
  Top Layer w0.157: 46.69,93.27 51.77,88.19 ; 50.8,81.98 50.8,87.3 K1.4
IF-BPF-OUT: length 16.5
  Top Layer w0.157: 50.8,49.47 50.8,35.62 52.07,34.35 U5.2
LO-AMP-OUT: length 26.7
  Top Layer w0.157: 63.38,36.77 61.85,36.77 61.85,33.89 62.87,32.87 60.64,32.87 60.59,32.82 R6.2 ; JP1.2 66.29,36.89 62.87,33.47 U6.3
LO-OUT: length 6
  Top Layer w0.157: U7.1 66.67,32.87 U6.1
LO-PI-PAD-OUT: length 3.9
  Top Layer w0.157: R3.2 R5.1 60.29,36.72 58.21,36.72 U5.6
LO-TRIM: length 85.9
  Bottom Layer w0.5: CN3.6 88.13,55.07 93.73,49.47 93.73,14.67 92.33,13.27 57.51,13.27 57.01,13.77 v2(57.01,14.37)
LO-VREF: length 12.2
  Top Layer w0.5: 63.99,17.56 63.96,17.59 R7.1 R9.1 ; 63.99,17.56 70.36,17.56 U7.3 ; 63.99,17.56 64.01,17.54 R10.1
NOISY-5.3V: length 88.1
  Top Layer w0.75: 37.59,25.8 38.23,26.43 v2(38.23,28.43)
  Inner2 w0.5: 87.66,75.7 87.25,75.7 67.87,56.32 43.56,56.32 38.23,50.99 38.23,28.43 ; CN2.6 CN2.5
NOISY-5V: length 48.6
  Inner2 w1: CN2.7 CN2.8 87.6,84.65 v1(75.05,84.65) v1(72.62,84.65) 60.24,84.65 54.36,90.53 54.36,93.57 52.22,95.71 51.78,95.73 51.69,95.82
  Bottom Layer w1: 51.77,95.81 50.8,96.78 D1.1
RLY-TXRX-EN: length 73.5
  Bottom Layer w0.25: K1.8 44.94,95.81 42.42,93.28 42.42,79.31 44.07,77.66 76.43,77.66 87.9,66.19 CN3.4 ; 47.4,98.62 47.4,96.62 46.69,95.9 46.69,95.81
RX: length 12.3
  Top Layer w0.157: 38.18,95.19 38.18,91.8 39.25,90.73 46.69,90.73
RX_TERMINATION: length 7
  Top Layer w0.157: R2.2 39.95,88.19 K1.5
TO-BPF: length 28
  Top Layer w0.157: 52.96,31.81 52.61,31.81 52.32,31.53 52.32,4.25
TX: length 13.8
  Top Layer w0.157: K1.3 60.5,90.73 61.85,92.08 SMA2.1
TX_TERMINATION: length 2.8
  Bottom Layer w0.157: 54.44,93.06 54.23,93.27 51.77,93.27

## Copper pours and planes (outline as drawn; the poured copper is in the pictures)
GND on Top Layer: 0,100 100,100 100,0 0,0
GND on Bottom Layer: 99.69,100 99.69,0.05 -0.25,0.05 -0.13,100
GND on Inner1: 99.89,99.81 99.89,-0.14 -0.06,-0.14 -0.06,99.81 47.5,100
GND on Inner2: 99.95,100 99.95,-0.08 0,-0.08 0,100

## Text on the board
Top Silkscreen Layer: To enable LO-trim: / Remove 0-Ohm resistor R11 / Place 0-Ohm resistor R10 | LO
